# Altium schematic sheet Вариант1.SchDoc
size A4; SheetNumber: 1; SheetTotal: 10
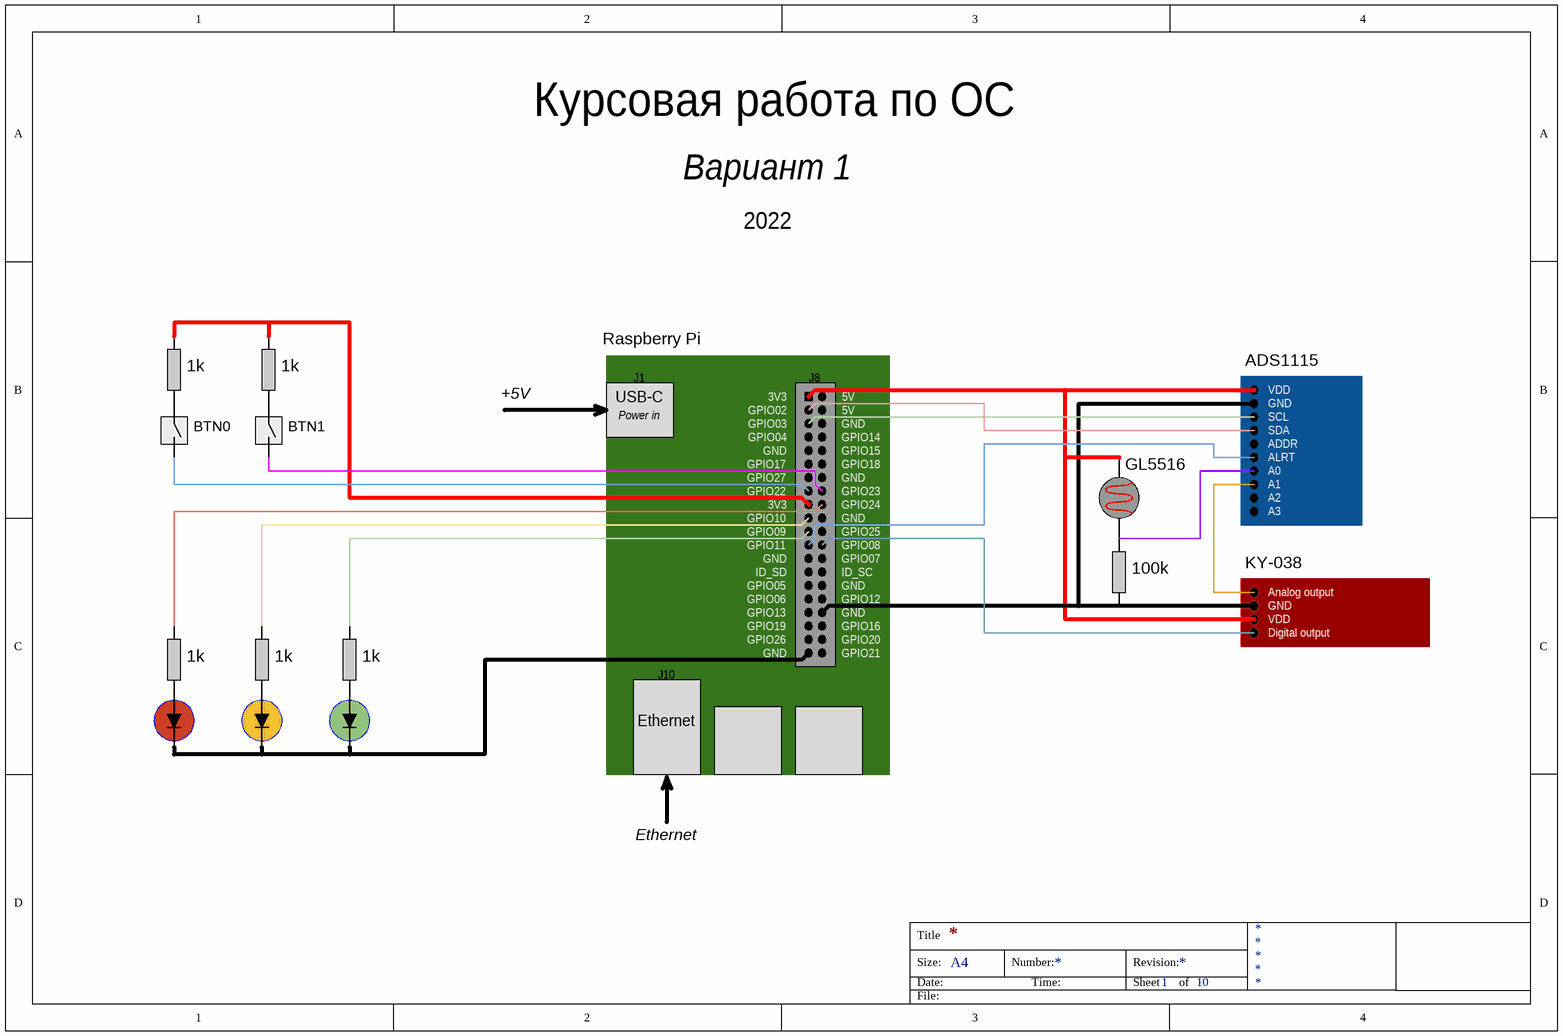
[diagram p0: Вариант1.SchDoc]

## Notes on the sheet
- Курсовая работа по ОС
- Вариант 1
- 2022
- 1k
- Raspberry Pi
- J1
- J8
- ADS1115
- VDD
- BTN0
- BTN1
- +5V
- USB-C
- Power in
- 3V3
- GPIO02
- GPIO03
- GPIO04
- GND
- GPIO14
- GPIO15
- 5V
- SCL
- SDA
- ADDR
- GPIO17
- GPIO27
- GPIO22
- GPIO10
- GPIO18
- GPIO23
- GPIO24
- GL5516
- ALRT
- A0
- A1
- A2
- A3
- GPIO09
- GPIO11
- GPIO05
- ID_SD
- GPIO25
- GPIO08
- GPIO07
- ID_SC
- 100k
- KY-038
- GPIO06
- GPIO13
- GPIO19
- GPIO26
- GPIO12
- GPIO16
- GPIO20
- GPIO21
- Analog output
- Digital output
- Ethernet
- J10
- Title
- Size:
- Date:
- A4
- Number:
- Time:
- Revision:
- Sheet
- of
- File: